# Altium schematic sheet Passive-buzzer-module_2025-10-18.schdoc
size 120 x 59 mm
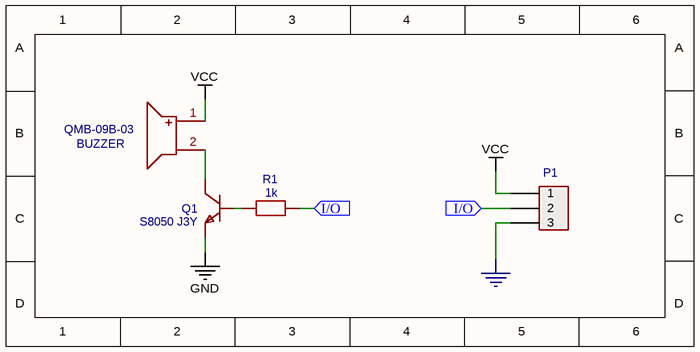
[diagram p0: Passive-buzzer-module_2025-10-18.schdoc]

## Parts
BUZZER  QMB-09B-03  [BUZ-TH_BD9.0-P4.00-D0.6-FD]
P1  Header-Male-2.54_1x3  [HDR-3X1/2.54]  (value not drawn)
Q1  S8050 J3Y  [SOT-23-3_L2.9-W1.3-P1.90-LS2.4-BR]
R1  1k  [R0603]

## Ports
I/O (in)

## Nets
GND: P1.3 Q1.2(E)
VCC: BUZZER.1 P1.1
I/O: P1.2 R1.1 ; port I/O
NetBUZZER_2: BUZZER.2 Q1.3(C)
NetQ1_1: Q1.1(B) R1.2

## Library data of the parts
BUZZER = QMB-09B-03: Manufacturer: 华能; Contributor: LCSC; Frequency: 2700Hz; Supplier: LCSC; Manufacturer Part: QMB-09B-03; Supplier Part: C96256; JLCPCB Part Class: Extended Part; spicePre: B; spiceSymbolName: QMB-09B-03
P1 = Header-Male-2.54_1x3: Manufacturer: LCSC; Supplier: LCSC; Manufacturer Part: Header-Male-2.54_1x3; spicePre: P; Supplier Part: C49257
Q1 = S8050 J3Y: Manufacturer: 集晶电子; Contributor: LCSC; Supplier: LCSC; Supplier Part: C2984677; Manufacturer Part: S8050; link: https://atta.szlcsc.com/upload/public/pdf/source/20220324/91AE03497B76884C7E1F259394868E6F.pdf; JLCPCB Part Class: Extended Part; spicePre: Q; spiceSymbolName: S8050_C2984677
R1 = 1k: nameAlias: Value(Ω); Contributor: LCEDA_Lib; Supplier Part: C21190; Supplier: LCSC; spicePre: R; spiceSymbolName: R_0603_EU